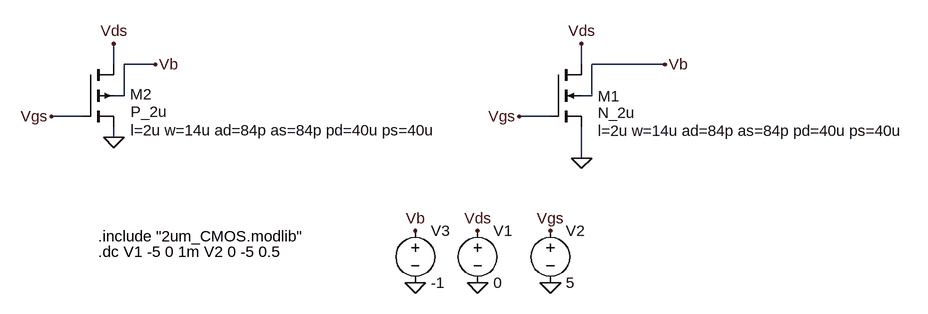
[diagram p0: schematic 1e_pMOS.asc]
1e_pMOS.asc, the LTspice schematic file:
Version 4
SHEET 1 1296 680
WIRE -64 112 -64 80
WIRE 0 112 -48 112
WIRE 656 112 656 80
WIRE 784 112 672 112
WIRE -48 160 -48 112
WIRE -48 160 -64 160
WIRE 672 160 672 112
WIRE 672 160 656 160
WIRE -112 192 -160 192
WIRE 608 192 560 192
WIRE -64 224 -64 208
WIRE 656 256 656 208
FLAG -160 192 Vgs
FLAG -64 80 Vds
FLAG 656 80 Vds
FLAG 560 192 Vgs
FLAG -64 224 0
FLAG 656 256 0
FLAG 608 448 0
FLAG 496 448 0
FLAG 496 368 Vds
FLAG 608 368 Vgs
FLAG 400 448 0
FLAG 400 368 Vb
FLAG 784 112 Vb
FLAG 0 112 Vb
SYMBOL nmos4 608 112 R0
WINDOW 0 73 49 Left 2
WINDOW 3 73 74 Left 2
WINDOW 123 73 102 Left 2
SYMATTR InstName M1
SYMATTR Value N_2u
SYMATTR Value2 l=2u w=14u ad=84p as=84p pd=40u ps=40u
SYMBOL pmos4 -112 112 R0
WINDOW 0 73 46 Left 2
WINDOW 3 74 73 Left 2
WINDOW 123 74 101 Left 2
SYMATTR InstName M2
SYMATTR Value P_2u
SYMATTR Value2 l=2u w=14u ad=84p as=84p pd=40u ps=40u
SYMBOL voltage 496 352 R0
WINDOW 123 0 0 Left 0
WINDOW 39 0 0 Left 0
SYMATTR InstName V1
SYMATTR Value 0
SYMBOL voltage 608 352 R0
WINDOW 123 0 0 Left 0
WINDOW 39 0 0 Left 0
SYMATTR InstName V2
SYMATTR Value 5
SYMBOL voltage 400 352 R0
WINDOW 123 0 0 Left 0
WINDOW 39 0 0 Left 0
SYMATTR InstName V3
SYMATTR Value -1
TEXT -88 376 Left 2 !.include "2um_CMOS.modlib"
TEXT -88 400 Left 2 !.dc V1 -5 0 1m V2 0 -5 0.5

The netlist it stands for:
* 1e_pMOS.asc
M1 Vds Vgs 0 Vb N_2u l=2u w=14u ad=84p as=84p pd=40u ps=40u
M2 Vds Vgs 0 Vb P_2u l=2u w=14u ad=84p as=84p pd=40u ps=40u
V1 Vds 0 0
V2 Vgs 0 5
V3 Vb 0 -1
.model NMOS NMOS
.model PMOS PMOS
.lib standard.mos
.include "2um_CMOS.modlib"
.dc V1 -5 0 1m V2 0 -5 0.5
.backanno
.end